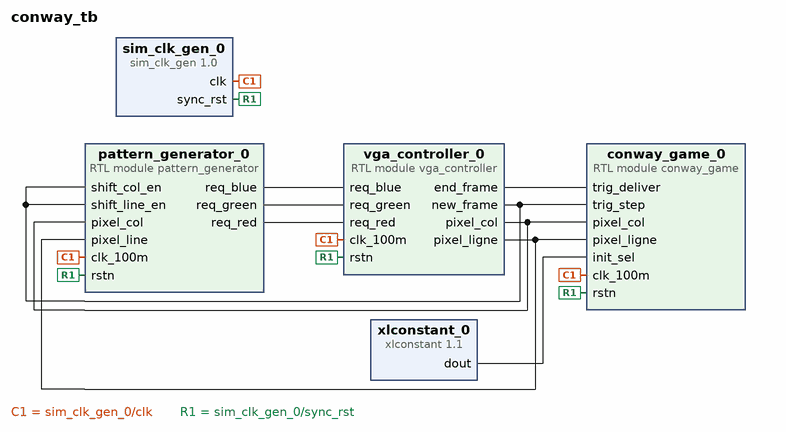
[diagram p0: block diagram of the top level]
# Vivado block design conway_tb, xc7a35tcpg236-1, Vivado 2024.2
create_bd_design conway_tb

create_bd_cell -type ip -vlnv xilinx.com:ip:sim_clk_gen:1.0 sim_clk_gen_0
create_bd_cell -type module -reference vga_controller vga_controller_0
create_bd_cell -type module -reference pattern_generator pattern_generator_0
create_bd_cell -type module -reference conway_game conway_game_0
create_bd_cell -type ip -vlnv xilinx.com:ip:xlconstant:1.1 xlconstant_0
set_property -dict {CONFIG.CONST_VAL 0} [get_bd_cells xlconstant_0]

# ---- connections ----

connect_bd_net [get_bd_pins pattern_generator_0/req_blue] [get_bd_pins vga_controller_0/req_blue]
connect_bd_net [get_bd_pins pattern_generator_0/req_green] [get_bd_pins vga_controller_0/req_green]
connect_bd_net [get_bd_pins pattern_generator_0/req_red] [get_bd_pins vga_controller_0/req_red]
connect_bd_net [get_bd_pins sim_clk_gen_0/clk] \
  [get_bd_pins pattern_generator_0/clk_100m] [get_bd_pins vga_controller_0/clk_100m] [get_bd_pins conway_game_0/clk_100m]
connect_bd_net [get_bd_pins sim_clk_gen_0/sync_rst] \
  [get_bd_pins pattern_generator_0/rstn] [get_bd_pins vga_controller_0/rstn] [get_bd_pins conway_game_0/rstn]
connect_bd_net [get_bd_pins vga_controller_0/end_frame] [get_bd_pins conway_game_0/trig_deliver]
connect_bd_net [get_bd_pins vga_controller_0/new_frame] \
  [get_bd_pins pattern_generator_0/shift_line_en] [get_bd_pins pattern_generator_0/shift_col_en] \
  [get_bd_pins conway_game_0/trig_step]
connect_bd_net [get_bd_pins vga_controller_0/pixel_col] [get_bd_pins pattern_generator_0/pixel_col] [get_bd_pins conway_game_0/pixel_col]
connect_bd_net [get_bd_pins vga_controller_0/pixel_ligne] [get_bd_pins pattern_generator_0/pixel_line] [get_bd_pins conway_game_0/pixel_ligne]
connect_bd_net [get_bd_pins xlconstant_0/dout] [get_bd_pins conway_game_0/init_sel]

validate_bd_design
save_bd_design
